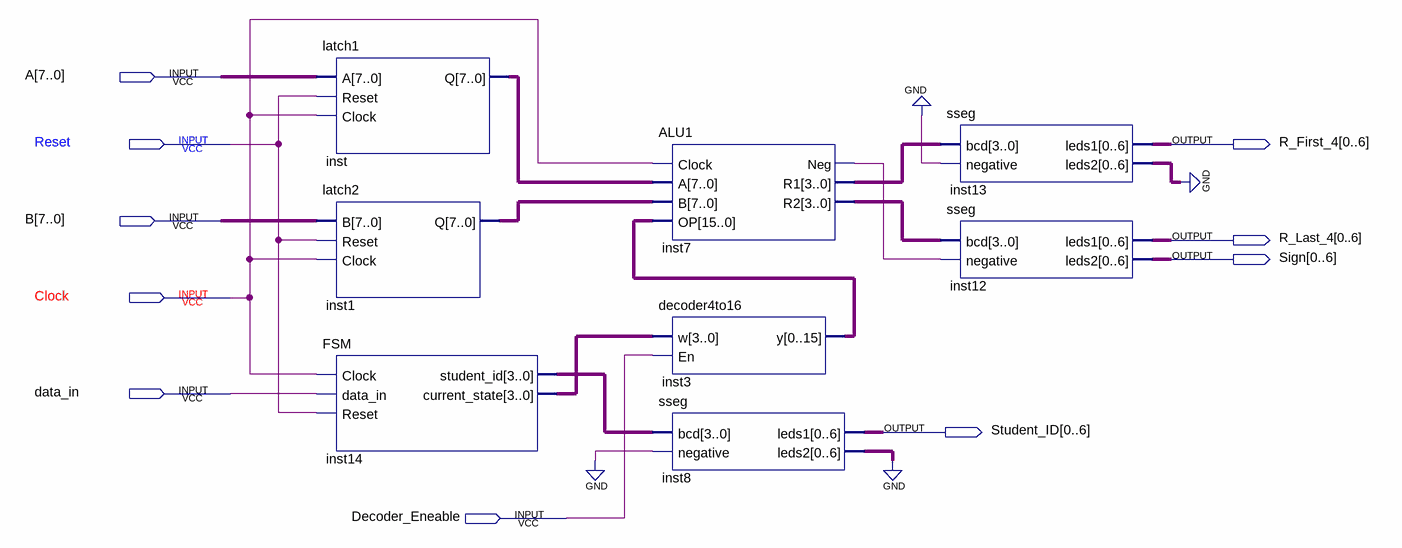
[diagram p0: schematic sheet]
// Quartus schematic Problem1.bdf as structural Verilog: 8 symbols, 10 pins
module Problem1 (
  input  [7:0] A,
  input  Reset,
  input  [7:0] B,
  input  Clock,
  input  data_in,
  input  Decoder_Eneable,
  output [0:6] R_First_4,
  output [0:6] R_Last_4,
  output [0:6] Sign,
  output [0:6] Student_ID
);

  wire inst7_neg;
  wire [3:0] inst7_r1, inst7_r2, inst14_current_state, inst14_student_id;
  wire [6:0] inst8_leds2, inst13_leds2;
  wire [7:0] inst1_q, inst_q;
  wire [15:0] inst3_y;

  latch1 inst (.A(A), .Reset(Reset), .Clock(Clock), .Q(inst_q));
  latch2 inst1 (.B(B), .Reset(Reset), .Clock(Clock), .Q(inst1_q));
  FSM inst14 (
    .Clock(Clock), .data_in(data_in), .Reset(Reset), .student_id(inst14_student_id),
    .current_state(inst14_current_state));
  ALU1 inst7 (.Clock(Clock), .A(inst_q), .B(inst1_q), .OP(inst3_y), .Neg(inst7_neg), .R1(inst7_r1), .R2(inst7_r2));
  decoder4to16 inst3 (.w(inst14_current_state), .En(Decoder_Eneable), .y(inst3_y));
  sseg inst8 (.bcd(inst14_student_id), .negative(1'b0), .leds1(Student_ID), .leds2(inst8_leds2));
  sseg inst13 (.bcd(inst7_r1), .negative(1'b0), .leds1(R_First_4), .leds2(inst13_leds2));
  sseg inst12 (.bcd(inst7_r2), .negative(inst7_neg), .leds1(R_Last_4), .leds2(Sign));
  // also tied to GND on the sheet: {inst13_leds2[0], inst13_leds2[1], inst13_leds2[2], inst13_leds2[3], inst13_leds2[4], inst13_leds2[5], inst13_leds2[6], inst8_leds2[0], inst8_leds2[1], inst8_leds2[2], inst8_leds2[3], inst8_leds2[4], inst8_leds2[5], inst8_leds2[6]}
endmodule
